# Altium schematic sheet V1.0.SchDoc
size 127 x 50 mm
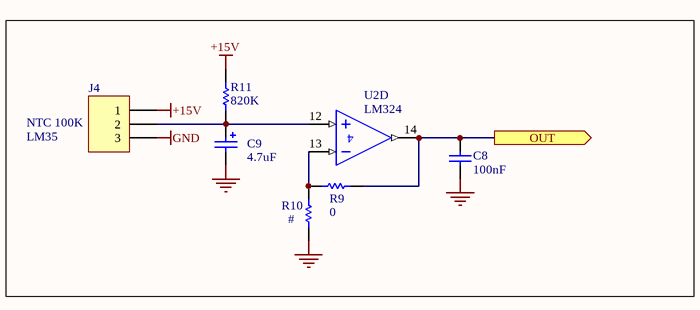
[diagram p0: V1.0.SchDoc]

## Parts
C8  100nF  [CAPNTO2.54-3.05x1.78A]
C9  4.7uF  [CAPPR2.5-6.3x5]
J4  3PIN  [Fonics_3PIN_1]  (value not drawn)
R9  0  [AXIAL-0.4]
R10  #  [AXIAL-0.4]
R11  820K  [AXIAL-0.4]
U2  LM324  [646-06]  (part D of 5)

## Ports
OUT (out)

## Nets
+15V: J4.1 R11.1
GND: C8.1 C9.2 J4.3 R10.2
OUT: C8.2 R9.1 U2.14(OUT) ; port OUT
NetC9_1: C9.1 J4.2 R11.2 U2.12(IN+)
NetR9_2: R9.2 R10.1 U2.13(IN-)

## Notes on the sheet
- (near J4) NTC 100K
- LM35

## Library data of the parts
C8 = Cap: Capacitor; Manufacturer: Generic Components; Class I: Passive; Published: 8-Jun-2000; Revision: July-2002: Re-released for DXP Platform.; Publisher: Altium Limited; Class II: Capacitor
C9 = Cap Pol1: Polarized Capacitor (Radial); Manufacturer: Generic Components; Class I: Passive; Published: 8-Jun-2000; Revision: July-2002: Re-released for DXP Platform.; Publisher: Altium Limited; Class II: Capacitor
J4 = Header 3: Header, 3-Pin; Manufacturer: Generic Components; Class I: Connector; Revision: July-2002: Re-released for DXP Platform.; Publisher: Altium Limited
R9-R11 = Res1: Resistor; Published: 8-Jun-2000; LatestRevisionDate: 17-Jul-2002; LatestRevisionNote: Re-released for DXP Platform.; PackageReference: AXIAL-0.3; Publisher: Altium Limited
U2 = LM324: Quad Low-Power Operational Amplifier; Published: 17-Jul-2002; LatestRevisionDate: 06-Jun-2005; LatestRevisionNote: Stylized 3D Model Added.; DatasheetVersion: 1988; PackageVersion: 1997; PackageReference: 646-06; Publisher: Altium Limited; PackageDescription: DIP; 14 Leads; Row Spacing 7.62 mm; Pitch 2.54 mm; ComponentLink1Description: Manufacturer Link; ComponentLink1URL: http://www.onsemi.com/site/products/parametrics/0,4446,251,00.html; ComponentLink2Description: Datasheet; ComponentLink2URL: http://www.onsemi.com/pub/Collateral/LM324-D.PDF